# EAGLE design pi_gpio_snd (EAGLE 9.3.1)
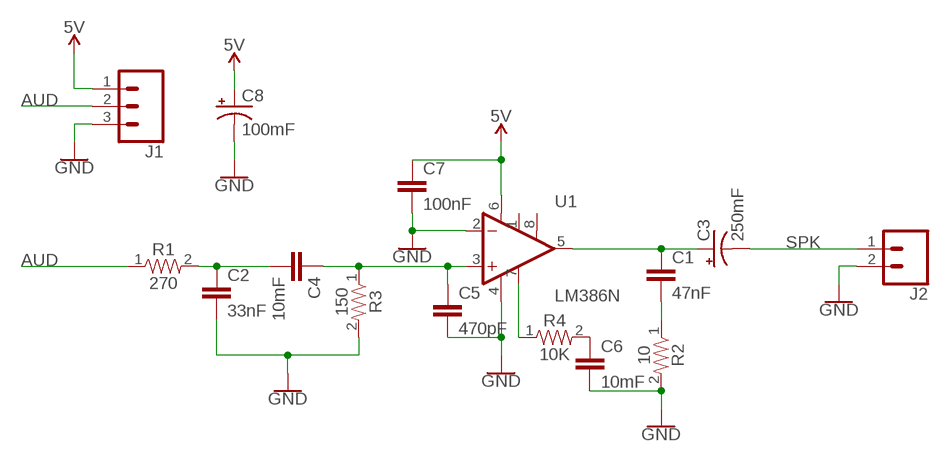
[diagram p0: schematic, sheet 1]

## Parts
C1  47nF  CAP-1206  [1206]
C2  33nF  CAP-1206  [1206]
C3  250mF  1000UF-RADIAL-5MM-25V-20%  [CPOL-RADIAL-5MM-10MM]
C4  10mF  CAP-805  [0805]
C5  470pF  CAP-1206  [1206]
C6  10mF  CAP-805  [0805]
C7  100nF  CAP-805  [0805]
C8  100mF  1000UF-RADIAL-5MM-25V-20%  [CPOL-RADIAL-5MM-10MM]
J1  CONN_03  [1X03]
J2  CONN_02  [1X02]
R1  270  RESISTOR-1206  [1206]
R2  10  RESISTOR-1206  [1206]
R3  150  RESISTOR-1206  [1206]
R4  10K  RESISTOR-1206  [1206]
U1  LM386N  LM386  [DIP08]

## Nets
5V: C7.1 C8.+ J1.1 U1.6(V+)
AUD: J1.2 R1.1
GND: C2.2 C5.2 C6.2 C7.2 C8.- J1.3 J2.2 R2.2 R3.2 U1.2(-IN) U1.4(V-)
N$1: C1.1 C3.+ U1.5(OUT)
N$2: C2.1 C4.2 R1.2
N$3: C4.1 C5.1 R3.1 U1.3(+IN)
N$4: C1.2 R2.1
N$5: R4.1 U1.7(BP)
N$6: C6.1 R4.2
SPK: C3.- J2.1
Unconnected: U1.1(GAIN) U1.8(GAIN)

## Library data of the parts
C1 C2 C4-C7 = myParts:CAP: Generic capacitor
C3 C8 = SparkFun-Capacitors:1000UF: 1,000µF/1mF ceramic capacitors A capacitor is a passive two-terminal electrical component used to store electrical energy temporarily in an electric field. CAP-08070; PROD_ID: CAP-09538; VALUE: 1mF
J1 = SparkFun-Connectors:CONN_03: Multi connection point. Often used as Generic Header-pin footprint for 0.1 inch spaced/style header connections On any of the 0.1 inch spaced packages, you can populate with these: Break Away Headers - Straight <https://www.sparkfun.com/products/116> (PRT-00116) Break Away Male Headers - Right Angle <https://www.sparkfun.com/products/553> (PRT-00553) Female Headers <https://www.sparkfun.com/products/115> (PRT-00115) Break Away Headers - Machine Pin <https://www.sparkfun.com/products/117> (PRT-00117) Break Away Female Headers - Swiss Machine Pin <https://www.sparkfun.com/products/743> (PRT-00743) Stackable Header - 3 Pin (Female, 0.1") <https://www.sparkfun.com/products/13875> (PRT-13875) For SCREWTERMINALS and SPRING TERMINALS visit here: Screw Terimnals on SparkFun.com <https://www.sparkfun.com/search/results?term=Screw+Terminals> (5mm/3.5mm/2.54mm spacing) This device is also useful as a general connection point to wire up your design to another part of your project. Our various solder wires solder well into these plated through hole pads. Hook-Up Wire - Assortment (Stranded, 22 AWG) <https://www.sparkfun.com/products/11375> (PRT-11375) Hook-Up Wire - Assortment (Solid Core, 22 AWG) <https://www.sparkfun.com/products/11367> (PRT-11367) View the entire wire category on our website here <https://www.sparkfun.com/categories/141> Special notes: Molex polarized connector foot print use with SKU : PRT-08232 with associated crimp pins and housings.
J2 = SparkFun-Connectors:CONN_02: Multi connection point. Often used as Generic Header-pin footprint for 0.1 inch spaced/style header connections On any of the 0.1 inch spaced packages, you can populate with these: Break Away Headers - Straight <https://www.sparkfun.com/products/116> (PRT-00116) Break Away Male Headers - Right Angle <https://www.sparkfun.com/products/553> (PRT-00553) Female Headers <https://www.sparkfun.com/products/115> (PRT-00115) Break Away Headers - Machine Pin <https://www.sparkfun.com/products/117> (PRT-00117) Break Away Female Headers - Swiss Machine Pin <https://www.sparkfun.com/products/743> (PRT-00743) For SCREWTERMINALS and SPRING TERMINALS visit here: Screw Terimnals on SparkFun.com <https://www.sparkfun.com/search/results?term=Screw+Terminals> (5mm/3.5mm/2.54mm spacing) This device is also useful as a general connection point to wire up your design to another part of your project. Our various solder wires solder well into these plated through hole pads. Hook-Up Wire - Assortment (Stranded, 22 AWG) <https://www.sparkfun.com/products/11375> (PRT-11375) Hook-Up Wire - Assortment (Solid Core, 22 AWG) <https://www.sparkfun.com/products/11367> (PRT-11367) View the entire wire category on our website here <https://www.sparkfun.com/categories/141> Special notes: Molex polarized connector foot print use with: PRT-08233 with associated crimp pins and housings. 2.54_SCREWTERM for use with PRT-10571. 3.5mm Screw Terminal footprints for PRT-08084 5mm Screw Terminal footprints for use with PRT-08432
R1-R4 = myParts:RESISTOR: Generic resistor
U1 = SparkFun-IC-Amplifiers:LM386: low voltage audio power amplifier SparkFun Products FabFM Radio Kit <https://www.sparkfun.com/products/11043> (KIT-11043); PROD_ID: IC-10899

## Board
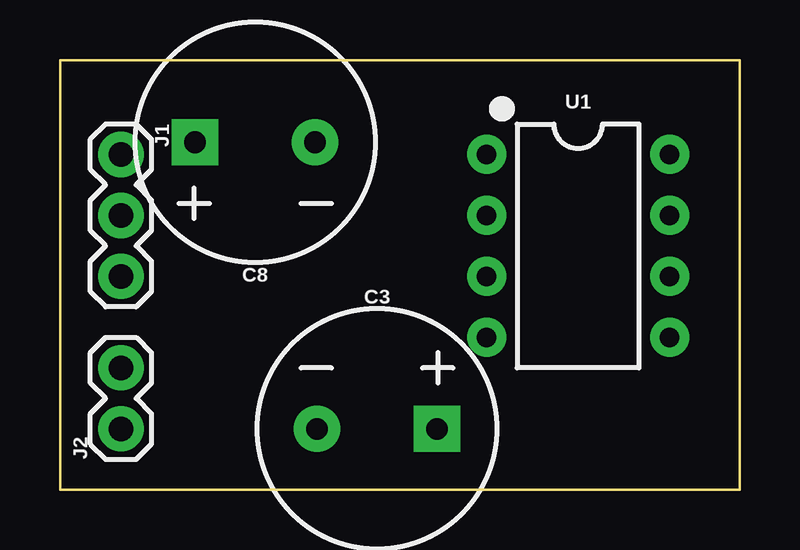
[diagram p1: board, top side]
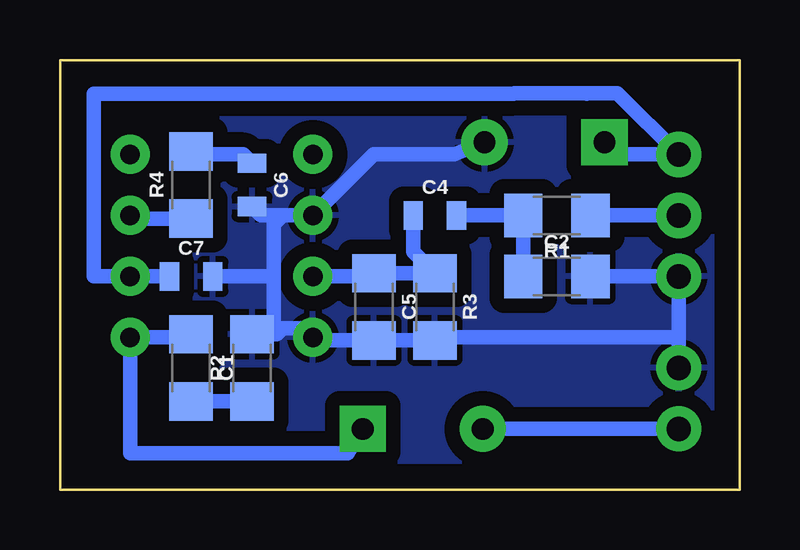
[diagram p2: board, bottom side, seen from below]

Size 28.32 x 17.91 mm. Coordinates in mm from the lower left corner, seen from the top.
Outline: 0,0 28.32,0 28.32,17.91 0,17.91 0,0
Copper layers (1*16): Top 0.035mm / dielectric 1.5mm / Bottom 0.035mm
Design rules "default": minimum track width 6mil, minimum drill 0.35mm, track to track 6mil, track to pad 6mil, pad to pad 6mil, via to via 6mil, smd to smd 6mil, copper to edge 40mil, drill to drill 6mil, minimum pad ring 10mil, minimum via ring 8mil, stop-mask expansion 4mil, vias tented up to drill 0mil, thermal gap 10mil

### Footprints (pad centres in the part's own frame; a part is rotated, then mirrored left to right if it is on the bottom)
1206 = smd 1.6 x 1.8: 1 -1.4,0; 2 1.4,0
CPOL-RADIAL-5MM-10MM = drill 0.9 pad 1.93 square: + 2.5,0 | drill 0.9 pad 1.93: - -2.5,0
0805 = smd 0.8 x 1.2: 1 -0.9,0; 2 0.9,0
1X03 = drill 1.016 pad 1.88: 1 0,0; 2 2.54,0; 3 5.08,0
1X02 = drill 1.016 pad 1.88: 1 0,0; 2 2.54,0
DIP08 = drill 0.813 pad 1.626: 1 -3.81,-3.81; 2 -1.27,-3.81; 3 1.27,-3.81; 4 3.81,-3.81; 5 3.81,3.81; 6 1.27,3.81; 7 -1.27,3.81; 8 -3.81,3.81

### Placement (x,y rotation side)
C1  22.86,5.08 270 bottom
C2  7.62,8.89 0 bottom
C3  13.21,2.54 0 top
C4  12.7,11.43 0 bottom
C5  15.24,7.62 270 bottom
C6  20.32,12.7 270 bottom
C7  22.86,8.89 0 bottom
C8  8.13,14.48 180 top
J1  2.54,13.97 270 top
J2  2.54,2.54 90 top
R1  7.62,11.43 180 bottom
R2  20.32,5.08 90 bottom
R3  12.7,7.62 270 bottom
R4  22.86,12.7 90 bottom
U1  21.59,10.16 270 top

### Tracks (layer width: path | path; a pad name or v marks a point on that pad's centre or on a via)
5V
  Bottom 0.61: J1.1 2.56,13.99 | C7.1 U1.6 26.92,8.89 26.92,16.51 9.41,16.51 9.4,16.52 6.35,16.52 | 6.35,16.52 5.09,16.52 J1.1 | 6.37,16.5 6.35,16.52 | J1.1 5.88,13.97 C8.+
AUD
  Bottom 0.61: J1.2 R1.1
GND
  Bottom 0.61: C2.2 J1.3 2.54,6.35 | 19.42,8.89 19.42,6.72 19.05,6.72 | 19.05,6.72 18.15,6.72 U1.4 17.65,6.22 C5.2 R3.2 12.57,6.35 2.54,6.35 | C7.2 19.42,8.89 | R2.2 19.29,6.48 19.05,6.72 | 19.05,11.43 U1.2 15.24,13.97 11.9,13.97 C8.- | 19.05,11.43 19.42,11.06 19.42,8.89 | C6.2 19.95,11.43 19.05,11.43 | J2.2 2.54,6.35
  pour Bottom (isolate 0.61): 0,17.78 27.94,17.78 27.94,0 0,0
N$1
  Bottom 0.61: C1.1 22.99,6.35 U1.5 25.4,1.52 16.33,1.52 C3.+
N$2
  Bottom 0.61: C2.1 R1.2 C4.2
N$3
  Bottom 0.61: C4.1 13.6,9.92 R3.1 C5.1 15.37,8.89 U1.3
N$4
  Bottom 0.61: C1.2 R2.1
N$5
  Bottom 0.61: U1.7 25.27,11.3 R4.1
N$6
  Bottom 0.61: C6.1 20.69,13.97 22.86,13.97 R4.2
SPK
  Bottom 0.61: C3.- J2.1

### Text on the board
tDocu: 5V / AUD / GND | GND / SPK